# Altium project IOT_nRF24L01_RELAY_TEST.PrjPcb
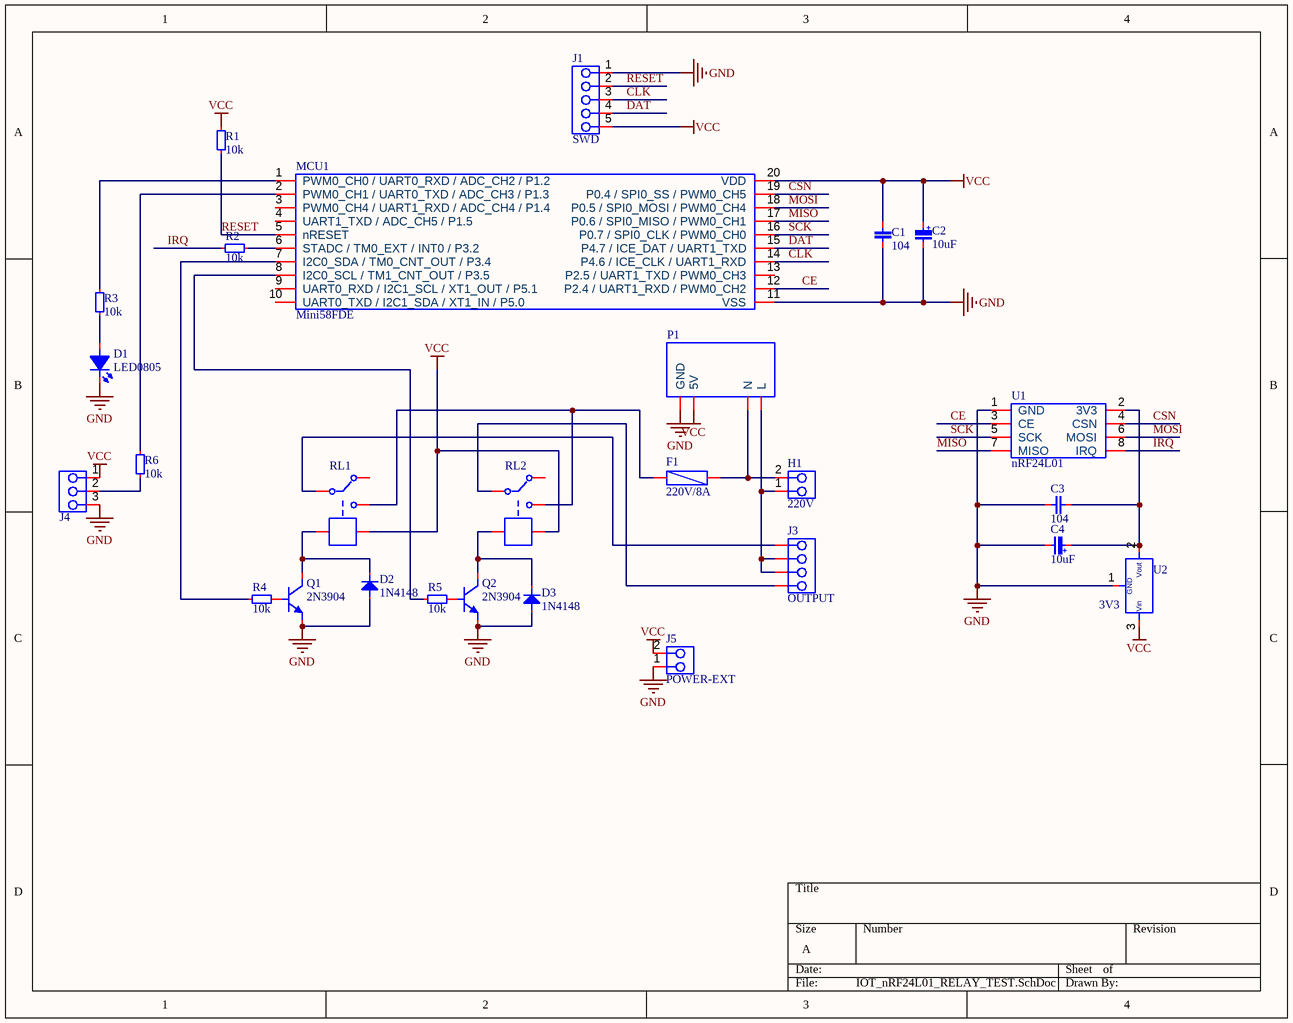
[diagram p0: IOT_nRF24L01_RELAY_TEST.SchDoc]
1 sheet, 27 parts. Net scope: global (net labels, ports and power ports of the same name join across sheets).
Board file: IOT_nRF24L01_RELAY_TEST.PcbDoc

## Sheet IOT_nRF24L01_RELAY_TEST.SchDoc
size A; SheetNumber: 1; SheetTotal: 1

### Parts
C1  104  [C0805]
C2  10uF  [CAP_RAD_D05x11]
C3  104  [C1206]
C4  10uF  [CAP_RAD_D05x11]
D1  LED0805  [L0805RED]
D2  1N4148  [SOD-80]
D3  1N4148  [SOD-80]
F1  220V/8A  [FUSE_Bel_MJS_V]
H1  220V  [TERMINAL-BLOCK-7.62MM -02PIN]
J1  SWD  [HEADER-MALE-05PINS-2.54MM]
J3  OUTPUT  [DG306-5.0-04P-12-00AH]
J4  HEADER-MALE-2.54MM  [HEADER-MALE-03PINS-2.54MM]  (value not drawn)
J5  POWER-EXT  [HEADER-MALE-02PINS-2.54MM]
MCU1  Mini58FDE  [TSSOP20_0.65_4.4]
P1  MODULE_5V_700mA  [MODULE_5V_700mA]  (value not drawn)
Q1  2N3904  [SOT23-3]
Q2  2N3904  [SOT23-3]
R1  10k  [R0805]
R2  10k  [R0805]
R3  10k  [R0805]
R4  10k  [R0805]
R5  10k  [R0805]
R6  10k  [R0805]
RL1  Relay-SONGLE-SRD-05VDC  [RELAY-SONGLE-SRD-05VDC_BLUE]  (value not drawn)
RL2  Relay-SONGLE-SRD-05VDC  [RELAY-SONGLE-SRD-05VDC_BLUE]  (value not drawn)
U1  nRF24L01  [nRF24L01]
U2  3V3  [SOT223-3]

### Nets
GND: C1.1 C2.2 C3.1 C4.2 D1.2(K) D2.1 D3.1 J1.1 J4.3 J5.1 MCU1.11(VSS) P1.4(GND) Q1.2(E) Q2.2(E) U1.1(GND) U2.1
VCC: C1.2 C2.1 J1.5 J4.1 J5.2 MCU1.20(VDD) P1.3(5V) R1.2 RL1.3 RL2.3 U2.3
CE: MCU1.12(P2.4_/_UART1_RXD_/_PWM0_CH2) U1.3(CE)
CLK: J1.3 MCU1.14(P4.6_/_ICE_CLK_/_UART1_RXD)
CSN: MCU1.19(P0.4_/_SPI0_SS_/_PWM0_CH5) U1.4(CSN)
DAT: J1.4 MCU1.15(P4.7_/_ICE_DAT_/_UART1_TXD)
IRQ: R2.1 U1.8(IRQ)
MISO: MCU1.17(P0.6_/_SPI0_MISO_/_PWM0_CH1) U1.7(MISO)
MOSI: MCU1.18(P0.5_/_SPI0_MOSI_/_PWM0_CH4) U1.6(MOSI)
RESET: J1.2 MCU1.5(nRESET) R1.1
SCK: MCU1.16(P0.7_/_SPI0_CLK_/_PWM0_CH0) U1.5(SCK)
NetC3_2: C3.2 C4.1 U1.2(3V3) U2.2
NetD1_1: D1.1(A) R3.1
NetD2_2: D2.2 Q1.3(C) RL1.1
NetD3_2: D3.2 Q2.3(C) RL2.1
NetF1_1: F1.1 RL1.4 RL2.4
NetF1_2: F1.2 H1.2 P1.2(N)
NetH1_1: H1.1 J3.2 J3.3 P1.1(L)
NetJ3_1: J3.1 RL2.2
NetJ3_4: J3.4 RL1.2
NetJ4_2: J4.2 R6.1
NetMCU1_1: MCU1.1(PWM0_CH0_/_UART0_RXD_/_ADC_CH2_/_P1.2) R3.2
NetMCU1_2: MCU1.2(PWM0_CH1_/_UART0_TXD_/_ADC_CH3_/_P1.3) R6.2
NetMCU1_6: MCU1.6(STADC_/_TM0_EXT_/_INT0_/_P3.2) R2.2
NetMCU1_7: MCU1.7(I2C0_SDA_/_TM0_CNT_OUT_/_P3.4) R4.1
NetMCU1_8: MCU1.8(I2C0_SCL_/_TM1_CNT_OUT_/_P3.5) R5.1
NetQ1_1: Q1.1(B) R4.2
NetQ2_1: Q2.1(B) R5.2

Not connected (* = marked no-connect by the designer): MCU1 3(PWM0_CH4_/_UART1_RXD_/_ADC_CH4_/_P1.4) 4(UART1_TXD_/_ADC_CH5_/_P1.5) 9(UART0_RXD_/_I2C1_SCL_/_XT1_OUT_/_P5.1) 10(UART0_TXD_/_I2C1_SDA_/_XT1_IN_/_P5.0) 13(P2.5_/_UART1_TXD_/_PWM0_CH3); RL1 5; RL2 5

### Notes on the sheet
- (in symbol Capacitor(Radian)) +
- (in symbol Ic-AMS1117(SOT-223)) Vout; GND; Vin

### Library data of the parts
C1 C3 = Capacitors(SMD)
C2 C4 = Capacitor(Radian)
D2 D3 = Diode-1N4148: The fast switching diode
F1 = Fuse-Vertical
H1 = TERMINAL-BLOCK-7.62MM-02PIN
J1 = HEADER-MALE-05PINS-2.54MM
J3 = DG306-5.0-04P-12-00AH
J4 = HEADER-MALE-03PINS-2.54MM
J5 = HEADER-MALE-02PINS-2.54MM
MCU1 = Mcu-Mini58FDE: Novoton 4Kb-RAM 32Kb-Flash
P1 = SMPS_5V_700mA
Q1 Q2 = Transistor-2N3904 (SOT-23)
R1-R6 = Resistors-SMD
U1 = Module-nRF24L01
U2 = Ic-AMS1117(SOT-223)